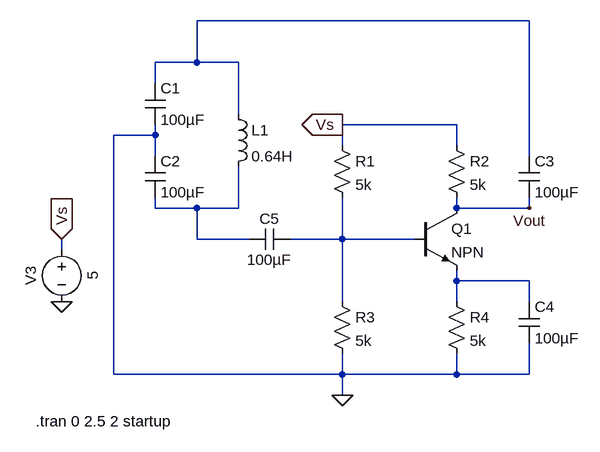
[diagram p0: schematic NPN-Colpitts-Oscillator.asc]
NPN-Colpitts-Oscillator.asc, the LTspice schematic file:
Version 4
SHEET 1 1648 680
WIRE 912 32 400 32
WIRE 400 96 400 32
WIRE 400 96 336 96
WIRE 464 96 400 96
WIRE 336 128 336 96
WIRE 464 176 464 96
WIRE 800 192 624 192
WIRE 336 208 336 192
WIRE 336 208 272 208
WIRE 624 224 624 192
WIRE 800 224 800 192
WIRE 336 240 336 208
WIRE 912 240 912 32
WIRE 336 320 336 304
WIRE 400 320 336 320
WIRE 464 320 464 256
WIRE 464 320 400 320
WIRE 800 320 800 304
WIRE 912 320 912 304
WIRE 912 320 800 320
WIRE 400 368 400 320
WIRE 480 368 400 368
WIRE 624 368 624 304
WIRE 624 368 544 368
WIRE 736 368 624 368
WIRE 192 384 192 368
WIRE 800 432 800 416
WIRE 912 432 800 432
WIRE 624 464 624 368
WIRE 800 464 800 432
WIRE 912 464 912 432
WIRE 272 576 272 208
WIRE 624 576 624 544
WIRE 624 576 272 576
WIRE 800 576 800 544
WIRE 800 576 624 576
WIRE 912 576 912 528
WIRE 912 576 800 576
WIRE 624 608 624 576
FLAG 192 464 0
FLAG 624 608 0
FLAG 192 368 Vs
IOPIN 192 368 In
FLAG 624 192 Vs
IOPIN 624 192 Out
FLAG 912 320 Vout
SYMBOL res 608 208 R0
SYMATTR InstName R1
SYMATTR Value 5k
SYMBOL res 784 208 R0
SYMATTR InstName R2
SYMATTR Value 5k
SYMBOL res 608 448 R0
SYMATTR InstName R3
SYMATTR Value 5k
SYMBOL res 784 448 R0
SYMATTR InstName R4
SYMATTR Value 5k
SYMBOL cap 896 240 R0
SYMATTR InstName C3
SYMATTR Value 100µF
SYMBOL cap 896 464 R0
SYMATTR InstName C4
SYMATTR Value 100µF
SYMBOL npn 736 320 R0
SYMATTR InstName Q1
SYMBOL cap 320 128 R0
SYMATTR InstName C1
SYMATTR Value 100µF
SYMBOL cap 320 240 R0
SYMATTR InstName C2
SYMATTR Value 100µF
SYMBOL ind 448 160 R0
SYMATTR InstName L1
SYMATTR Value 0.64H
SYMBOL cap 544 352 R90
WINDOW 0 0 32 VBottom 2
WINDOW 3 32 32 VTop 2
SYMATTR InstName C5
SYMATTR Value 100µF
SYMBOL voltage 192 368 M0
WINDOW 0 32 56 VTop 2
WINDOW 3 -32 56 VBottom 2
WINDOW 123 0 0 Left 0
WINDOW 39 0 0 Left 0
SYMATTR InstName V3
SYMATTR Value 5
TEXT 152 648 Left 2 !.tran 0 2.5 2 startup

The netlist it stands for:
* NPN-Colpitts-Oscillator.asc
R1 Vs N003 5k
R2 Vs Vout 5k
R3 N003 0 5k
R4 N004 0 5k
C3 N001 Vout 100µF
C4 N004 0 100µF
Q1 Vout N003 N004 0 NPN
C1 N001 0 100µF
C2 0 N002 100µF
L1 N001 N002 0.64H
C5 N003 N002 100µF
V3 Vs 0 5
.model NPN NPN
.model PNP PNP
.lib standard.bjt
.tran 0 2.5 2 startup
.backanno
.end